# Altium project SensorBoard.PrjPcb
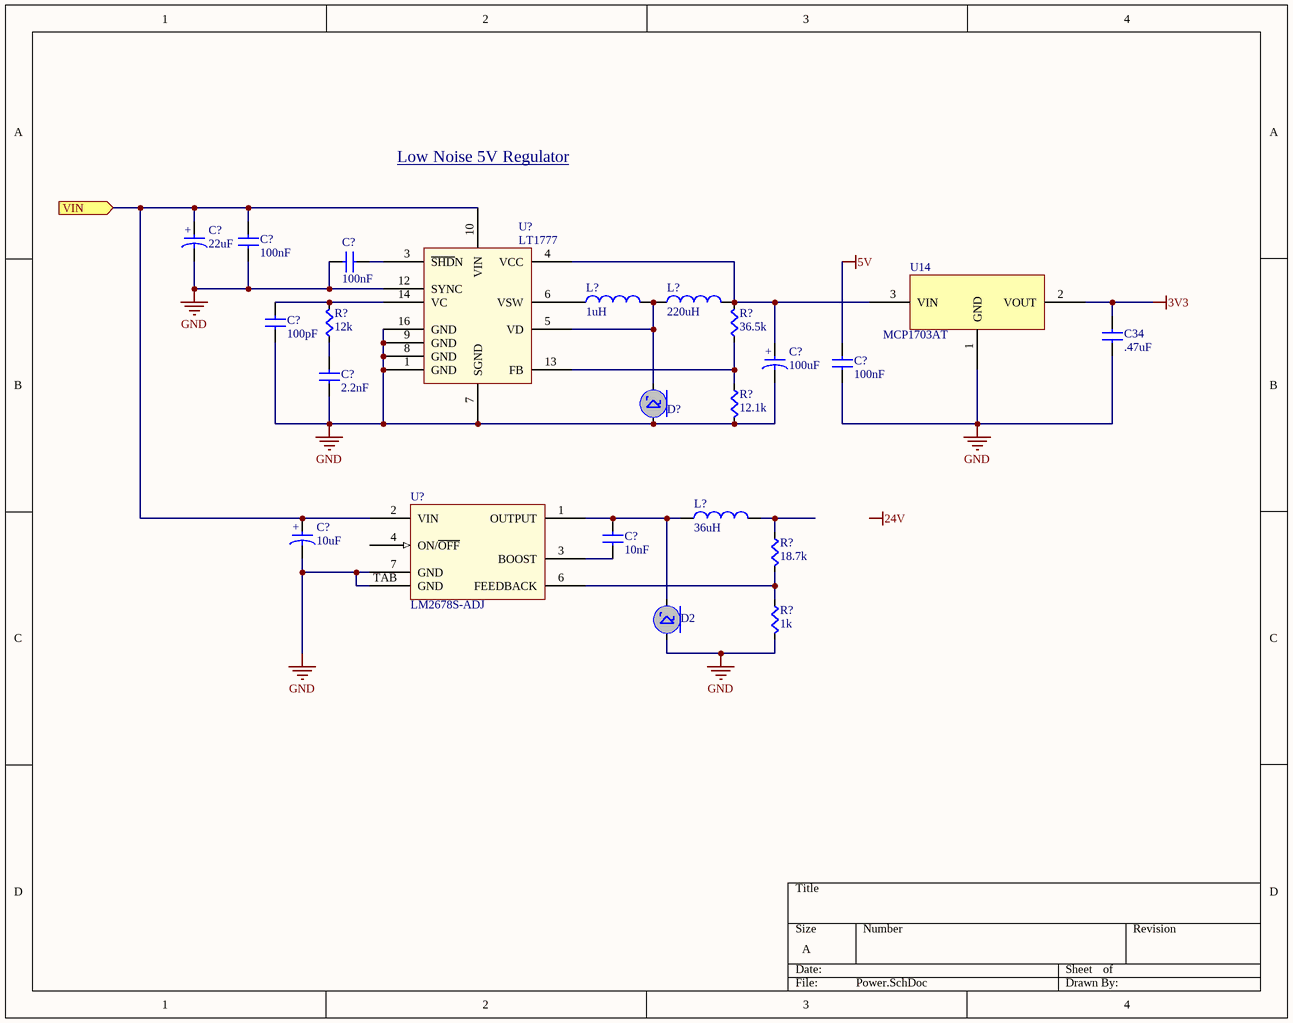
[diagram p0: Power.SchDoc]
5 sheets, 45 parts. Net scope: flat (ports and power ports of the same name join across sheets).
Sheets:
  Power.SchDoc
  Serial.SchDoc
  Top.SchDoc
  DVL.SchDoc
  Depth.SchDoc

## Sheet Power.SchDoc
size A

### Parts
(Parts that share a designator on the sheet are numbered #1, #2 ... from top to bottom, then left to right.)
C34  value .47uF  [CAPC0603]  (hidden comment: Cap)
C?#1  value 22uF  [CAPP0603]  (hidden comment: CapPol)
C?#2  value 100nF  [CAPC0603]  (hidden comment: Cap)
C?#3  value 100nF  [CAPC0603]  (hidden comment: Cap)
C?#4  value 100pF  [CAPC0603]  (hidden comment: Cap)
C?#5  value 100uF  [CAPP0603]  (hidden comment: CapPol)
C?#6  value 100nF  [CAPC0603]  (hidden comment: Cap)
C?#7  value 2.2nF  [CAPC0603]  (hidden comment: Cap)
C?#8  value 10uF  [CAPP0603]  (hidden comment: CapPol)
C?#9  value 10nF  [CAPC0603]  (hidden comment: Cap)
D2  DFLS160  [POWERDI123]  (value not drawn)
D?  Schottky  [1N5819HW-7-F]  (value not drawn)
L?#1  Inductance: 1uH  [SLF7045]  (hidden comment: Inductor)
L?#2  Inductance: 220uH  [SLF7045]  (hidden comment: Inductor)
L?#3  Inductance: 36uH  [SLF7045]  (hidden comment: Inductor)
R?#1  value 12k  [RES0603]  (hidden comment: Res)
R?#2  value 36.5k  [RES0603]  (hidden comment: Res)
R?#3  value 12.1k  [RES0603]  (hidden comment: Res)
R?#4  value 18.7k  [RES0603]  (hidden comment: Res)
R?#5  value 1k  [RES0603]  (hidden comment: Res)
U14  MCP1703AT  [MCP1703AT-xx02EMB]
U?#1  LT1777
U?#2  LM2678S-ADJ  [LM2678S]

### Ports
VIN (in)

### Nets
3V3: C34.1(A) U14.2(VOUT)
5V: C?#6.1(A)
GND: C34.2(B) C?#1.2(B) C?#2.2(B) C?#3.1(A) C?#4.1(A) C?#5.2(B) C?#6.2(B) C?#7.1(A) C?#8.2(B) D2.A D?.A R?#3.1(A) R?#5.1(A) U14.1(GND) U?#1.1(GND) U?#1.7(SGND) U?#1.8(GND) U?#1.9(GND) U?#1.12(SYNC) U?#1.16(GND) U?#2.7(GND) U?#2.TAB(GND)
NetC?#1_1: C?#1.1(A) C?#2.1(A) C?#8.1(A) U?#1.10(VIN) U?#2.2(VIN) ; port VIN
NetC?#3_2: C?#3.2(B) U?#1.3(~{SHD}N)
NetC?#4_2: C?#4.2(B) R?#1.1(A) U?#1.14(VC)
NetC?#5_1: C?#5.1(A) L?#2.2(B) R?#2.1(A) U14.3(VIN) U?#1.4(VCC)
NetC?#7_2: C?#7.2(B) R?#1.2(B)
NetC?#9_1: C?#9.1(A) D2.C L?#3.1(A) U?#2.1(OUTPUT)
NetC?#9_2: C?#9.2(B) U?#2.3(BOOST)
NetD?_C: D?.C L?#1.2(B) L?#2.1(A) U?#1.5(VD)
NetL?#1_1: L?#1.1(A) U?#1.6(VSW)
NetL?#3_2: L?#3.2(B) R?#4.2(B)
NetR?#2_2: R?#2.2(B) R?#3.2(B) U?#1.13(FB)
NetR?#4_1: R?#4.1(A) R?#5.2(B) U?#2.6(FEEDBACK)

Not connected (* = marked no-connect by the designer): U?#2 4(ON/~{OFF})

### Notes on the sheet
- Low Noise 5V Regulator
- Labels drawn without touching a wire or pin: 24V
- (in symbol CapPol) +

### Library data of the parts
D2 = DFLS160: 1.0A Surface Mount Schottky Barrier Rectifier; Supplier 1: Digi-Key; Supplier Part Number 1: DFLS160DICT-ND
D? = Schottky: Schottky Diode Template
U14 = MCP1703AT: 250 mA, 16V, Low Quiescent Current LDO Regulator; Supplier 1: Digi-Key; Supplier Part Number 1: MCP1703AT-3302E/MBTR-ND
U?#1 = LT1777: Low Noise Step-Down Switching Regulator; Supplier 1: Digi-Key; Supplier Part Number 1: LT1777CS#PBF-ND
U?#2 = LM2678S: Simple Switcher High Efficiency 5A Step-Down Voltage Regulator; Supplier 1: Digi-Key; Supplier Part Number 1: LM2678SX-ADJ/NOPBCT-ND
C34 C?#2-C?#4 C?#6 C?#7 C?#9 = Cap: Supplier 1: Digi-Key
  C34: Supplier Part Number 1: 445-7465-1-ND
  C?#2-C?#4 C?#6 C?#7: Supplier Part Number 1: 1276-1000-1-ND
  C?#9: Supplier Part Number 1: 1276-1009-1-ND
C?#1 C?#5 C?#8 = CapPol: Supplier 1: Digi-Key
  C?#1: Supplier Part Number 1: C1608JB0G226M080AA
  C?#5 C?#8: Supplier Part Number 1: 493-2880-1-ND
L?#1-L?#3 = Inductor
  L?#3: Supplier 1: Digi-Key; Supplier Part Number 1: 553-1129-ND
R?#1-R?#5 = Res: Supplier 1: Digi-Key
  R?#1: Supplier Part Number 1: RMCF0603JT12K0CT-ND
  R?#2: Supplier Part Number 1: RMCF0603FT36K5
  R?#3: Supplier Part Number 1: RMCF0603FT12K1CT-ND
  R?#4: Supplier Part Number 1: RMCF0603FT18R7CT-ND
  R?#5: Supplier Part Number 1: RMCF0603FT1K00CT-ND

## Sheet Serial.SchDoc
size A
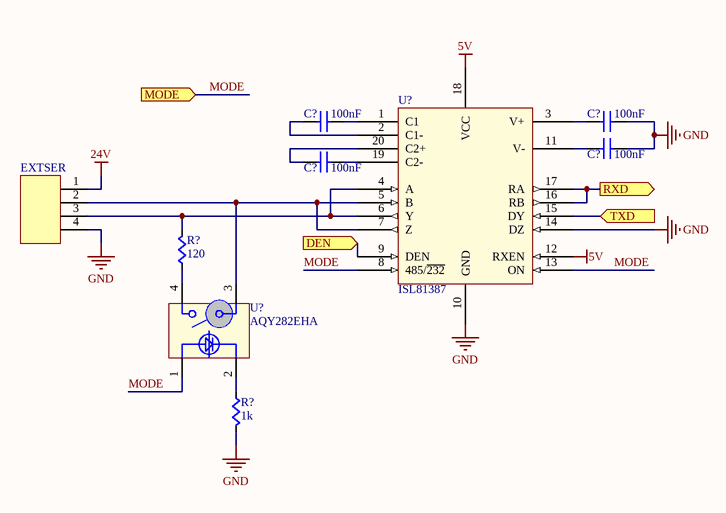
[diagram p1: Serial.SchDoc]

### Parts
(Parts that share a designator on the sheet are numbered #1, #2 ... from top to bottom, then left to right.)
C?#10  value 100nF  [CAPC0603]  (hidden comment: Cap)
C?#11  value 100nF  [CAPC0603]  (hidden comment: Cap)
C?#12  value 100nF  [CAPC0603]  (hidden comment: Cap)
C?#13  value 100nF  [CAPC0603]  (hidden comment: Cap)
EXTSER  MOLEX-HDR-1x4-SHERLOCK_RA  [MOLEX-HDR-1X4-SHERLOCK-RA]  (value not drawn)
R?#6  value 120  [RES0603]  (hidden comment: Res)
R?#7  value 1k  [RES0603]  (hidden comment: Res)
U?#3  ISL81387  [ISL81387IAZ]
U?#4  AQY282EHA  [AQY282EHA]

### Ports
DEN (in), MODE (in), RXD (out), TXD (in)

### Nets
5V: U?#3.12(RXEN) U?#3.18(VCC)
24V: EXTSER.1
GND: C?#11.2(B) C?#12.2(B) EXTSER.4 R?#7.1(A) U?#3.10(GND) U?#3.14(DZ)
MODE: U?#3.8(485/~{232}) U?#3.13(ON) U?#4.1(A) ; port MODE
NetC?#10_1: C?#10.1(A) U?#3.2(C1-)
NetC?#10_2: C?#10.2(B) U?#3.1(C1)
NetC?#11_1: C?#11.1(A) U?#3.3(V+)
NetC?#12_1: C?#12.1(A) U?#3.11(V-)
NetC?#13_1: C?#13.1(A) U?#3.20(C2+)
NetC?#13_2: C?#13.2(B) U?#3.19(C2-)
NetEXTSER_2: EXTSER.2 U?#3.5(B) U?#3.7(Z) U?#4.3(S2)
NetEXTSER_3: EXTSER.3 R?#6.1(A) U?#3.4(A) U?#3.6(Y)
NetR?#6_2: R?#6.2(B) U?#4.4(S1)
NetR?#7_2: R?#7.2(B) U?#4.2(C)
NetU?#3_9: U?#3.9(DEN) ; port DEN
NetU?#3_15: U?#3.15(DY) ; port TXD
NetU?#3_16: U?#3.16(RB) U?#3.17(RA) ; port RXD

### Library data of the parts
EXTSER = MOLEX-HDR-1x4-SHERLOCK_RA: Header, Molex, 2mm Pitch Sherlock Header, Single Row, Horizontal, 4 Circuits, Length 3.3mm; Manufacturer Part Number: 0353630460; Supplier Part Number: WM18933-ND; Manufacturer: Molex; Supplier: Digikey
U?#3 = ISL81387: 5V RS-232/RS-485 Transceiver; Supplier 1: Digi-Key; Supplier Part Number 1: ISL81387IAZ-TCT-ND
U?#4 = AQY282EHA: PhotoMOS Solid State Relay; Supplier 1: Digi-Key; Supplier Part Number 1: AQY282EHA-ND
C?#10-C?#13 = Cap: Supplier 1: Digi-Key; Supplier Part Number 1: 1276-1000-1-ND
R?#6 R?#7 = Res: Supplier 1: Digi-Key
  R?#6: Supplier Part Number 1: RMCF0603JT10K0CT-ND
  R?#7: Supplier Part Number 1: RHM1.0KGCT-ND

## Sheet Top.SchDoc
size A

## Sheet DVL.SchDoc
size A
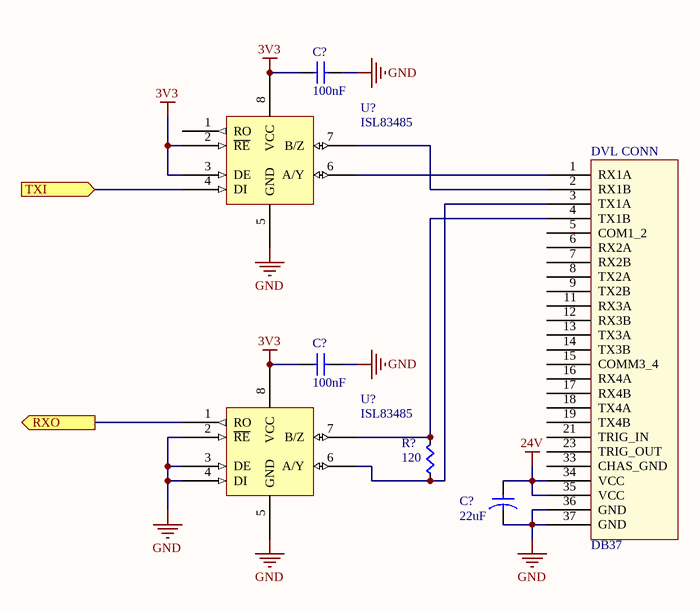
[diagram p2: DVL.SchDoc]

### Parts
(Parts that share a designator on the sheet are numbered #1, #2 ... from top to bottom, then left to right.)
C?#14  value 100nF  [CAPC0603]  (hidden comment: Cap)
C?#15  value 100nF  [CAPC0603]  (hidden comment: Cap)
C?#16  value 22uF  [CAP22uF100V]  (hidden comment: CapPol)
DVL_CONN  DB37  [DSUB37_ FEMALE]
R?#8  value 120  [RES0603]  (hidden comment: Res)
U?#5  ISL83485  [ISL8348xIBZ]
U?#6  ISL83485  [ISL8348xIBZ]

### Ports
RXO (out), TXI (in)

### Nets
3V3: C?#14.1(A) C?#15.1(A) U?#5.2(~{RE}) U?#5.3(DE) U?#5.8(VCC) U?#6.8(VCC)
24V: C?#16.1(A) DVL_CONN.34(VCC) DVL_CONN.35(VCC)
GND: C?#14.2(B) C?#15.2(B) C?#16.2(B) DVL_CONN.36(GND) DVL_CONN.37(GND) U?#5.5(GND) U?#6.2(~{RE}) U?#6.3(DE) U?#6.4(DI) U?#6.5(GND)
NetDVL_CONN_1: DVL_CONN.1(RX1A) U?#5.6(A/Y)
NetDVL_CONN_2: DVL_CONN.2(RX1B) U?#5.7(B/Z)
NetDVL_CONN_3: DVL_CONN.3(TX1A) R?#8.2(B) U?#6.6(A/Y)
NetDVL_CONN_4: DVL_CONN.4(TX1B) R?#8.1(A) U?#6.7(B/Z)
NetU?#5_4: U?#5.4(DI) ; port TXI
NetU?#6_1: U?#6.1(RO) ; port RXO

Not connected (* = marked no-connect by the designer): DVL_CONN 5(COM1_2) 6(RX2A) 7(RX2B) 8(TX2A) 9(TX2B) 11(RX3A) 12(RX3B) 13(TX3A) 14(TX3B) 15(COMM3_4) 16(RX4A) 17(RX4B) 18(TX4A) 19(TX4B) 21(TRIG_IN) 23(TRIG_OUT) 33(CHAS_GND); U?#5 1(RO)

### Library data of the parts
DVL_CONN = DVLCONN: DVL Connector using DSUB37; Manufacturer: FCI; Manufacturer Part Number: 10090098-S374VLF; Supplier 1: Digikey; Supplier Part Number 1: 609-4001-ND
U?#5 U?#6 = ISL83485: 3.3V RS485 Transceiver; Supplier 1: Digi-Key; Supplier Part Number 1: ISL83485IBZ-ND
C?#14 C?#15 = Cap: Supplier 1: Digi-Key; Supplier Part Number 1: 1276-1000-1-ND
C?#16 = CapPol: Supplier 1: Digi-Key; Supplier Part Number 1: P5310-ND
R?#8 = Res: Supplier 1: Digi-Key; Supplier Part Number 1: RMCF0603JT10K0CT-ND

## Sheet Depth.SchDoc
size A
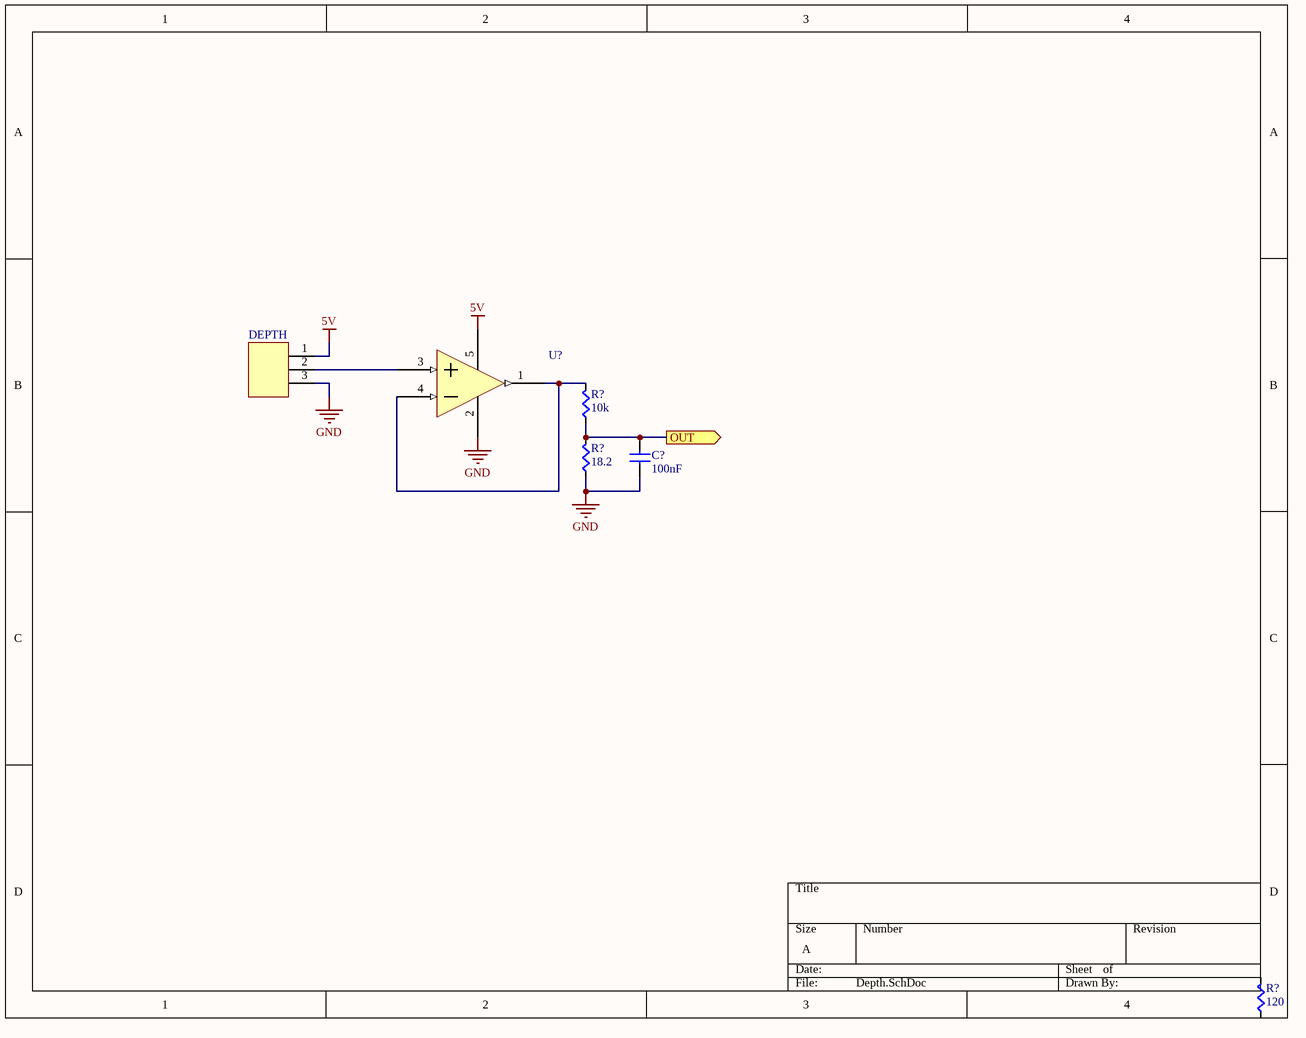
[diagram p3: Depth.SchDoc]

### Parts
(Parts that share a designator on the sheet are numbered #1, #2 ... from top to bottom, then left to right.)
C?#17  value 100nF  [CAPC0603]  (hidden comment: Cap)
DEPTH  3pos RA sherlock connector  [MOLEX-HDR-1X3-SHERLOCK-RA]  (value not drawn)
R?#9  value 10k  [RES0603]  (hidden comment: Res)
R?#10  value 18.2  [RES0603]  (hidden comment: Res)
R?#11  value 120  [RES0603]  (hidden comment: Res)
U?#7  MCP6L01  [MCP6L01R]  (value not drawn)

### Ports
OUT (out)

### Nets
5V: DEPTH.1 U?#7.5(VDD)
GND: C?#17.2(B) DEPTH.3 R?#10.2(B) U?#7.2(VSS)
NetC?#17_1: C?#17.1(A) R?#9.2(B) R?#10.1(A) ; port OUT
NetDEPTH_2: DEPTH.2 U?#7.3(VIN+)
NetR?#9_1: R?#9.1(A) U?#7.1(VOUT) U?#7.4(VIN-)

Not connected (* = marked no-connect by the designer): R?#11 1(A) 2(B)

### Library data of the parts
DEPTH = MOLEX-HDR-1x3-SHERLOCK_RA: Header, Molex, 2mm Pitch Sherlock Header, Single Row, Right Angle 3 Circuits, Length 3.3mm; Manufacturer Part Number: 35363-0360; Manufacturer: Molex Connector Corporation; Supplier Part Number: WM18932-ND; Supplier: Digi-Key
U?#7 = MCP6L01: Op Amp Rail-to-Rail 1Mhz; Supplier 1: Digi-Key; Supplier Part Number 1: MCP6L01T-E/OTCT-ND
C?#17 = Cap: Supplier 1: Digi-Key; Supplier Part Number 1: 1276-1000-1-ND
R?#9-R?#11 = Res: Supplier 1: Digi-Key
  R?#9: Supplier Part Number 1: RR08P10.0KDCT-ND
  R?#10: Supplier Part Number 1: P18.2BMCT-ND
  R?#11: Supplier Part Number 1: RMCF0603JT10K0CT-ND

## Nets that join several sheets
3V3: Power (C34.1 U14.2), DVL (6 pins)
5V: Power (C?#6.1), Serial (U?#3.12 U?#3.18), Depth (DEPTH.1 U?#7.5)
24V: Serial (EXTSER.1), DVL (C?#16.1 DVL_CONN.34 DVL_CONN.35)
GND: Power (22 pins), Serial (6 pins), DVL (10 pins), Depth (C?#17.2 DEPTH.3 R?#10.2 U?#7.2)